# EAGLE design finalbspd (EAGLE 9.6.2)
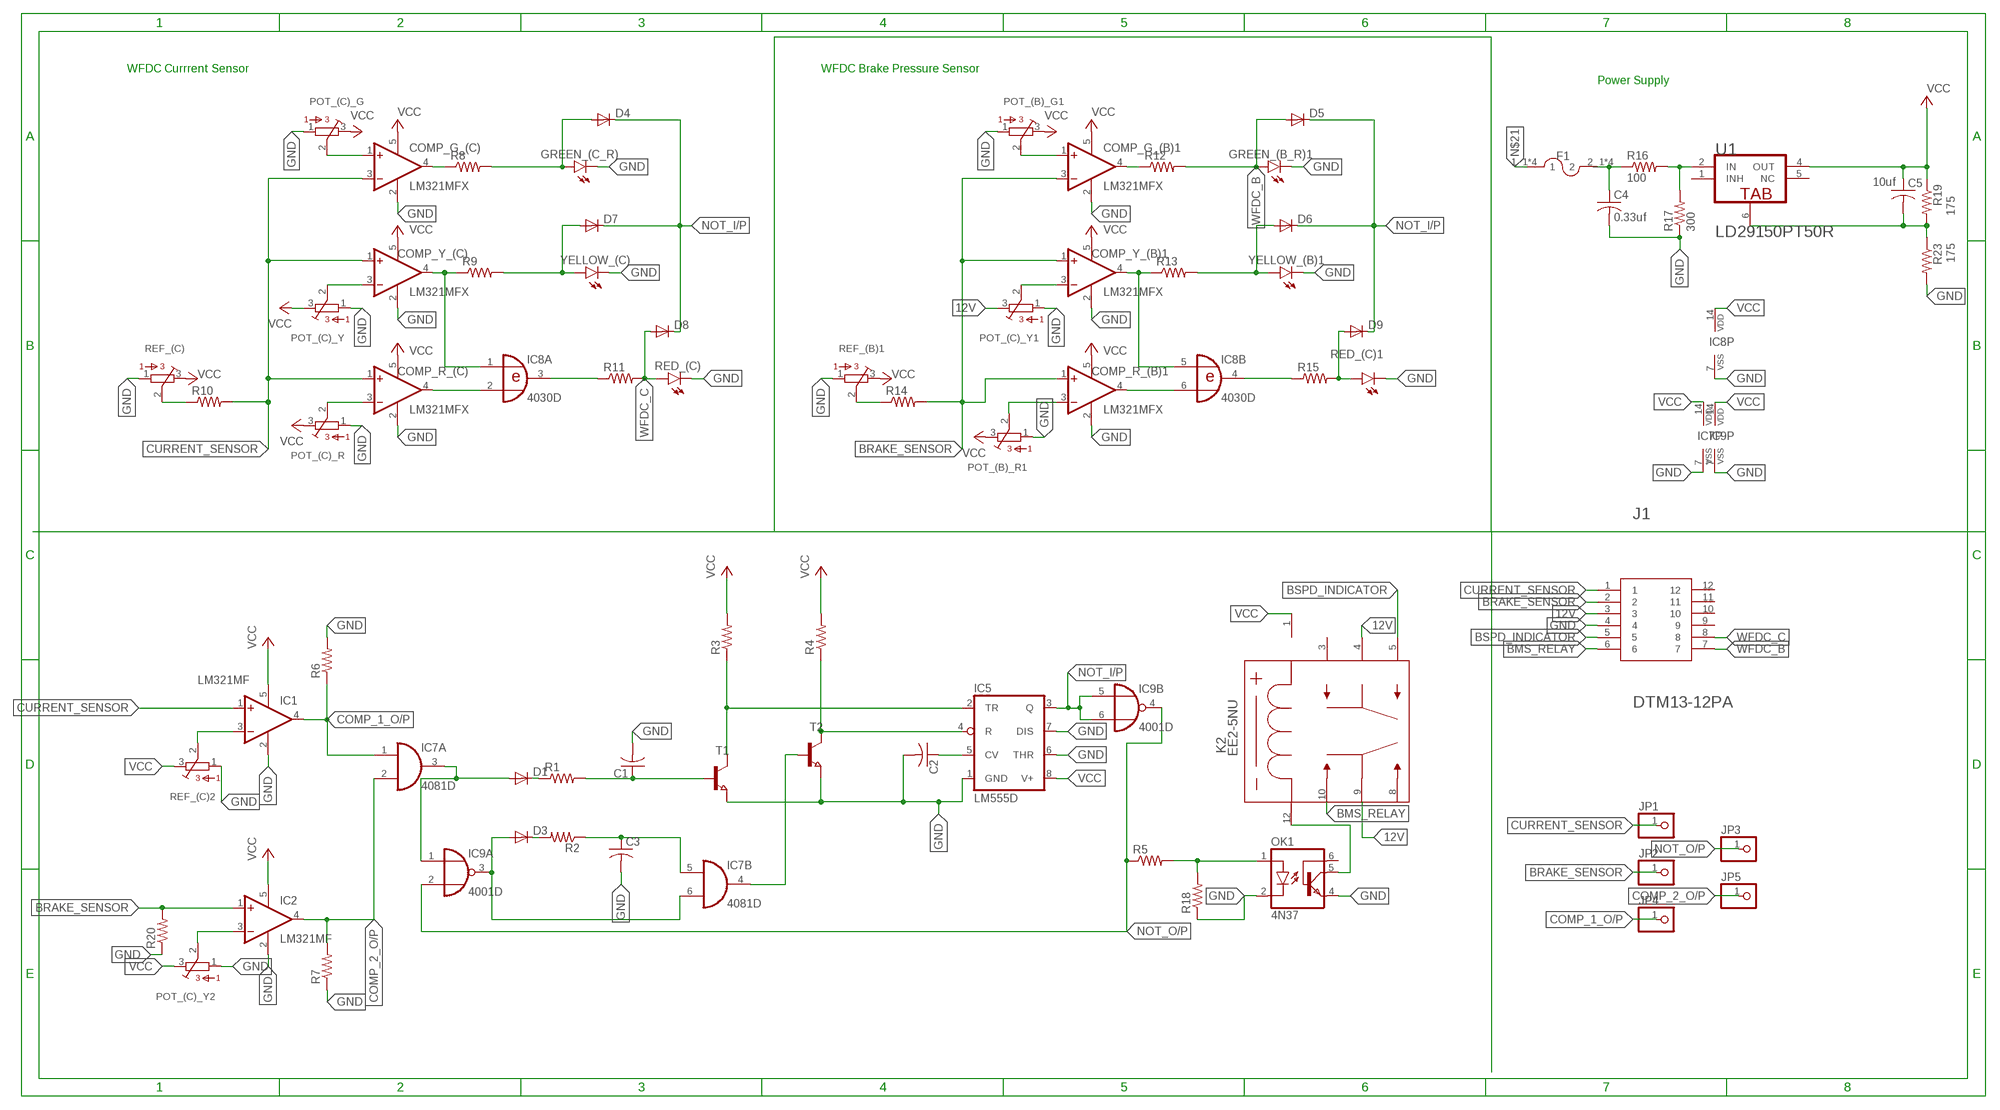
[diagram p0: schematic, sheet 1]

## Parts
C1  C-USC0402  [C0402]
C2  C-USC0402  [C0402]
C3  C-USC0402  [C0402]
C4  0.33uf  C-USC0402  [C0402]
C5  10uf  C-USC0402  [C0402]
COMP_G_(B)1  LM321MFX  [SOT23-5]
COMP_G_(C)  LM321MFX  [SOT23-5]
COMP_R_(B)1  LM321MFX  [SOT23-5]
COMP_R_(C)  LM321MFX  [SOT23-5]
COMP_Y_(B)1  LM321MFX  [SOT23-5]
COMP_Y_(C)  LM321MFX  [SOT23-5]
D1  DIODE-DO214AC  [DO214AC]
D3  DIODE-DO214AC  [DO214AC]
D4  DIODE-DO214AC  [DO214AC]
D5  DIODE-DO214AC  [DO214AC]
D6  DIODE-DO214AC  [DO214AC]
D7  DIODE-DO214AC  [DO214AC]
D8  DIODE-DO214AC  [DO214AC]
D9  DIODE-DO214AC  [DO214AC]
F1  178.4265.0002  [FUSE_178.4265.0002]
GREEN_(B_R)1  GREEN_(C)  LEDCHIP-LED0805  [CHIP-LED0805]
GREEN_(C_R)  GREEN_(C)  LEDCHIP-LED0805  [CHIP-LED0805]
IC1  LM321MF  [SOT23-5]
IC2  LM321MF  [SOT23-5]
IC5  LM555D  [SO08]
IC7  4081D  [SO14]
IC8  4030D  [SO14]
IC9  4001D  [SO14]
J1  DTM13-12PA  [TE_DTM13-12PA]
JP1  PINHD-1X1  [1X01]
JP2  PINHD-1X1  [1X01]
JP3  PINHD-1X1  [1X01]
JP4  PINHD-1X1  [1X01]
JP5  PINHD-1X1  [1X01]
K2  EE2-5NU  [EE2NU_KEM]
OK1  4N37  [DIL06]
POT_(B)_G1  3386-W  [3386W]
POT_(B)_R1  3386-W  [3386W]
POT_(C)_G  3386-W  [3386W]
POT_(C)_R  3386-W  [3386W]
POT_(C)_Y  3386-W  [3386W]
POT_(C)_Y1  3386-W  [3386W]
POT_(C)_Y2  3386-W  [3386W]
R1  R-US_M1406  [M1406]
R2  R-US_M1406  [M1406]
R3  R-US_M1406  [M1406]
R4  R-US_M1406  [M1406]
R5  R-US_M1406  [M1406]
R6  R-US_M1406  [M1406]
R7  R-US_M1406  [M1406]
R8  R-US_R1206  [R1206]
R9  R-US_R1206  [R1206]
R10  R-US_R1206  [R1206]
R11  R-US_R1206  [R1206]
R12  R-US_R1206  [R1206]
R13  R-US_R1206  [R1206]
R14  R-US_R1206  [R1206]
R15  R-US_R1206  [R1206]
R16  100  R-US_R1206  [R1206]
R17  300  R-US_R1206  [R1206]
R18  R-US_M1406  [M1406]
R19  175  R-US_R1206  [R1206]
R20  R-US_M1406  [M1406]
R23  175  R-US_R1206  [R1206]
RED_(C)  LEDCHIP-LED0805  [CHIP-LED0805]
RED_(C)1  LEDCHIP-LED0805  [CHIP-LED0805]
REF_(B)1  3386-W  [3386W]
REF_(C)  3386-W  [3386W]
REF_(C)2  3386-W  [3386W]
T1  NPN-TRANSISTOR_SOT23  [SOT23]
T2  NPN-TRANSISTOR_SOT23  [SOT23]
U1  STMICROELECTRONICS_LD29150PT50RSTMICROELECTRONICS_LD29150PT50R_0_2  [STMICROELECTRONICS_LD29150PT50R_2]
YELLOW_(B)1  LEDCHIP-LED0805  [CHIP-LED0805]
YELLOW_(C)  LEDCHIP-LED0805  [CHIP-LED0805]

## Nets
12V: C4.1 F1.2_1 F1.2_2 F1.2_3 F1.2_4 J1.3 K2.4 K2.9 POT_(C)_Y1.3 R16.1
BMS_RELAY: J1.6 K2.10
BRAKE_SENSOR: COMP_G_(B)1.3(-IN) COMP_R_(B)1.1(+IN) COMP_Y_(B)1.1(+IN) IC2.1(+IN) J1.2 JP2.1 R14.2 R20.2
BSPD_INDICATOR: J1.5 K2.5
COMP_1_O/P: IC1.4(OUT) IC7.1(A:I0) JP4.1 R6.1
COMP_2_O/P: IC2.4(OUT) IC7.2(A:I1) JP5.1 R7.2
CURRENT_SENSOR: COMP_G_(C).3(-IN) COMP_R_(C).1(+IN) COMP_Y_(C).1(+IN) IC1.1(+IN) J1.1 JP1.1 R10.2
GND: C1.2 C2.2 C3.2 C4.2 COMP_G_(B)1.2(V-) COMP_G_(C).2(V-) COMP_R_(B)1.2(V-) COMP_R_(C).2(V-) COMP_Y_(B)1.2(V-) COMP_Y_(C).2(V-) GREEN_(B_R)1.C GREEN_(C_R).C IC1.2(V-) IC2.2(V-) IC5.1(GND) IC5.6(THR) IC5.7(DIS) IC7.7(P:VSS) IC8.7(P:VSS) IC9.7(P:VSS) J1.4 OK1.2(C) OK1.4(EMI) POT_(B)_G1.1 POT_(B)_R1.1 POT_(C)_G.1 POT_(C)_R.1 POT_(C)_Y1.1 POT_(C)_Y2.1 POT_(C)_Y.1 R6.2 R7.1 R17.1 R18.1 R20.1 R23.2 RED_(C)1.C RED_(C).C REF_(B)1.1 REF_(C)2.1 REF_(C).1 T1.2(E) T2.2(E) YELLOW_(B)1.C YELLOW_(C).C
N$2: C1.1 R1.2 T1.1(B)
N$3: IC1.3(-IN) REF_(C)2.2
N$4: IC2.3(-IN) POT_(C)_Y2.2
N$5: COMP_R_(B)1.3(-IN) POT_(B)_R1.2
N$6: K2.12 OK1.5(COL)
N$7: D1.A IC7.3(A:O) IC9.1(A:I0)
N$8: C2.1 IC5.5(CV)
N$9: D1.C R1.1
N$10: D3.A IC7.6(B:I1) IC9.3(A:O)
N$11: D3.C R2.2
N$12: C3.1 IC7.5(B:I0) R2.1
N$14: IC5.2(TR) R3.1 T1.3(C)
N$15: IC5.4(R) R4.1 T2.3(C)
N$16: COMP_G_(C).4(OUT) R8.1
N$17: OK1.1(A) R5.2 R18.2
N$18: IC7.4(B:O) T2.1(B)
N$20: R16.2 R17.2 U1.2(IN)
N$21: F1.1_1 F1.1_2 F1.1_3 F1.1_4
N$22: COMP_Y_(C).4(OUT) IC8.1(A:I0) R9.1
N$23: COMP_R_(C).4(OUT) IC8.2(A:I1)
N$24: D4.A GREEN_(C_R).A R8.2
N$26: R10.1 REF_(C).2
N$27: COMP_Y_(C).3(-IN) POT_(C)_Y.2
N$28: IC8.3(A:O) R11.1
N$29: COMP_G_(B)1.4(OUT) R12.1
N$30: COMP_Y_(B)1.4(OUT) IC8.5(B:I0) R13.1
N$31: COMP_R_(B)1.4(OUT) IC8.6(B:I1)
N$33: D9.A R15.2 RED_(C)1.A
N$34: D7.A R9.2 YELLOW_(C).A
N$35: R14.1 REF_(B)1.2
N$36: COMP_Y_(B)1.3(-IN) POT_(C)_Y1.2
N$37: IC8.4(B:O) R15.1
N$38: D6.A R13.2 YELLOW_(B)1.A
N$39: C5.2 R19.2 R23.1 U1.6(TAB)
NOT_I/P: D4.C D5.C D6.C D7.C D8.C D9.C IC5.3(Q) IC9.5(B:I0) IC9.6(B:I1)
NOT_O/P: IC9.2(A:I1) IC9.4(B:O) JP3.1 R5.1
VCC: C5.1 COMP_G_(B)1.1(+IN) COMP_G_(B)1.5(V+) COMP_G_(C).1(+IN) COMP_G_(C).5(V+) COMP_R_(B)1.5(V+) COMP_R_(C).3(-IN) COMP_R_(C).5(V+) COMP_Y_(B)1.5(V+) COMP_Y_(C).5(V+) IC1.5(V+) IC2.5(V+) IC5.8(V+) IC7.14(P:VDD) IC8.14(P:VDD) IC9.14(P:VDD) K2.1 POT_(B)_G1.2 POT_(B)_G1.3 POT_(B)_R1.3 POT_(C)_G.2 POT_(C)_G.3 POT_(C)_R.2 POT_(C)_R.3 POT_(C)_Y2.3 POT_(C)_Y.3 R3.2 R4.2 R19.1 REF_(B)1.3 REF_(C)2.3 REF_(C).3 U1.4(OUT)
WFDC_B: D5.A GREEN_(B_R)1.A J1.7 R12.2
WFDC_C: D8.A J1.8 R11.2 RED_(C).A
Unconnected: IC7.8(C:I0) IC7.9(C:I1) IC7.10(C:O) IC7.11(D:O) IC7.12(D:I0) IC7.13(D:I1) IC8.8(C:I0) IC8.9(C:I1) IC8.10(C:O) IC8.11(D:O) IC8.12(D:I0) IC8.13(D:I1) IC9.8(C:I0) IC9.9(C:I1) IC9.10(C:O) IC9.11(D:O) IC9.12(D:I0) IC9.13(D:I1) J1.9 J1.10 J1.11 J1.12 K2.3 K2.8 OK1.6(BAS) U1.1(INH) U1.5(NC)

## Notes on the sheet
- WFDC Currrent Sensor | WFDC Brake Pressure Sensor
- Power Supply

## Library data of the parts
C1-C5 = adafruit:C-US: CAPACITOR, American symbol
COMP_G_(B)1 COMP_G_(C) COMP_R_(B)1 COMP_R_(C) COMP_Y_(B)1 COMP_Y_(C) IC1 IC2 = linear:LM321?*: Low Power Single Op Amp Source: http://cache.national.com/ds/LM/LM321.pdf
D1 D3-D9 = diode:DIODE-: DIODE
F1 = 178.4265.0002:178.4265.0002: Fuse holder [Littelfuse] 178.4265.0002 Fuse holder 4005084016264 Buy Part <https://snapeda.com/parts/178.4265.0002/Littelfuse%20Inc./view-part/?ref=eda>; ARROW_ELECTRONICS-PURCHASE-URL: https://snapeda.com/shop?store=Arrow+Electronics&id=1314086; AVAILABILITY: Warning; DESCRIPTION: Fuse Block 58V 1 Circuit Blade Through Hole; DIGIKEY-PURCHASE-URL: https://snapeda.com/shop?store=DigiKey&id=1314086; MF: Littelfuse Inc.; MOUSER-PURCHASE-URL: https://snapeda.com/shop?store=Mouser&id=1314086; MP: 178.4265.0002; PACKAGE: None; PRICE: None
GREEN_(B_R)1 GREEN_(C_R) RED_(C) RED_(C)1 YELLOW_(B)1 YELLOW_(C) = led:LED: LED OSRAM: - CHIPLED LG R971, LG N971, LY N971, LG Q971, LY Q971, LO R971, LY R971 LH N974, LH R974 LS Q976, LO Q976, LY Q976 LO Q996 - Hyper CHIPLED LW Q18S LB Q993, LB Q99A, LB R99A - SideLED LS A670, LO A670, LY A670, LG A670, LP A670 LB A673, LV A673, LT A673, LW A673 LH A674 LY A675 LS A676, LA A676, LO A676, LY A676, LW A676 LS A679, LY A679, LG A679 - Hyper Micro SIDELED® LS Y876, LA Y876, LO Y876, LY Y876 LT Y87S - SmartLED LW L88C, LW L88S LB L89C, LB L89S, LG L890 LS L89K, LO L89K, LY L89K LS L896, LA L896, LO L896, LY L896 - TOPLED LS T670, LO T670, LY T670, LG T670, LP T670 LSG T670, LSP T670, LSY T670, LOP T670, LYG T670 LG T671, LOG T671, LSG T671 LB T673, LV T673, LT T673, LW T673 LH T674 LS T676, LA T676, LO T676, LY T676, LB T676, LH T676, LSB T676, LW T676 LB T67C, LV T67C, LT T67C, LS T67K, LO T67K, LY T67K, LW E67C LS E67B, LA E67B, LO E67B, LY E67B, LB E67C, LV E67C, LT E67C LW T67C LS T679, LY T679, LG T679 LS T770, LO T770, LY T770, LG T770, LP T770 LB T773, LV T773, LT T773, LW T773 LH T774 LS E675, LA E675, LY E675, LS T675 LS T776, LA T776, LO T776, LY T776, LB T776 LHGB T686 LT T68C, LB T68C - Hyper Mini TOPLED® LB M676 - Mini TOPLED Santana® LG M470 LS M47K, LO M47K, LY M47K Source: http://www.osram.convergy.de LUXEON: - LUMILED® LXK2-PW12-R00, LXK2-PW12-S00, LXK2-PW14-U00, LXK2-PW14-V00 LXK2-PM12-R00, LXK2-PM12-S00, LXK2-PM14-U00 LXK2-PE12-Q00, LXK2-PE12-R00, LXK2-PE12-S00, LXK2-PE14-T00, LXK2-PE14-U00 LXK2-PB12-K00, LXK2-PB12-L00, LXK2-PB12-M00, LXK2-PB14-N00, LXK2-PB14-P00, LXK2-PB14-Q00 LXK2-PR12-L00, LXK2-PR12-M00, LXK2-PR14-Q00, LXK2-PR14-R00 LXK2-PD12-Q00, LXK2-PD12-R00, LXK2-PD12-S00 LXK2-PH12-R00, LXK2-PH12-S00 LXK2-PL12-P00, LXK2-PL12-Q00, LXK2-PL12-R00 Source: www.luxeon.com KINGBRIGHT: KA-3528ASYC Source: www.kingbright.com
IC5 = adafruit:*555: TIMER Changed DIP package to have round (not oval) pin pads http://www.ladyada.net/library/pcb/eaglelibrary.html
IC7 = 40xx:4081: Quad 2-input AND
IC8 = 40xx:4030: Quad XOR
IC9 = 40xx:4001: Quad 2-input NOR
J1 = DTM13-12PA:DTM13-12PA: 12 way DTM13 A key Receptacle with PCB mount and 90 degree molded pins. Sealable, with centerline pitch .165 inch/4 m...; COMMENT: DTM13-12PA; DESCRIPTION: 12 way DTM13 A key Receptacle with PCB mount and 90 degree molded pins. Sealable, with centerline pitch .165 inch/4 millimeters. Gray.; DIGI-KEY_PART_NUMBER: 1734-1130-ND; DIGIKEY-PURCHASE-URL: https://snapeda.com/shop?store=DigiKey&id=570989; EU_ROHS_COMPLIANCE: Compliant; MF: TE Connectivity; MOUSER-PURCHASE-URL: https://snapeda.com/shop?store=Mouser&id=570989; MP: DTM13-12PA; PACKAGE: None
JP1-JP5 = adafruit:PINHD-1X1: Pin header 1x1 for 0.1" spacing With round pins
K2 = 5V EE NUX:EE2-5NU; BUILT_BY: EMA_UL_Team; MANUFACTURER_PART_NUMBER: EE2-5NU; SOURCELIBRARY: Kemet_2014-12-31; VENDOR: KEMET
OK1 = optocoupler:4N37: OPTO COUPLER Source: http://www.fairchildsemi.com/pf/4N/4N35-M.html; MF: FAIRCHILD SEMICONDUCTOR; MPN: 4N37; OC_FARNELL: 1612456; OC_NEWARK: 72K9948
POT_(B)_G1 POT_(B)_R1 POT_(C)_G POT_(C)_R POT_(C)_Y POT_(C)_Y1 POT_(C)_Y2 REF_(B)1 REF_(C) REF_(C)2 = bourns:3386-: 3386 Series 3/8" Square Trimmer
R1-R7 R18 R20 = adafruit:R-US_: RESISTOR, American symbol
R8-R17 R19 R23 = rcl:R-US_: RESISTOR, American symbol; SPICEPREFIX: R
T1 T2 = semicon-smd-ipc:NPN-TRANSISTOR_: NPN TRANSISTOR
U1 = STMicroelectronics - LD29150PT50R:STMICROELECTRONICS_LD29150PT50R: PM-REG-LD29150-SOT5; CIIVA_IDS: 1497735; COMPONENT_LINK_1_DESCRIPTION: Manufacturer URL; COMPONENT_LINK_1_URL: http://www.st.com; DATASHEET: http://www.st.com/internet/com/TECHNICAL_RESOURCES/TECHNICAL_LITERATURE/DATASHEET/CD00003403.pdf; DATASHEET_VERSION: 27/10/2010; FOOTPRINT_VARIANT_NAME_0: Level C; FOOTPRINT_VARIANT_NAME_1: Level B; FOOTPRINT_VARIANT_NAME_2: Level A; IMPORTED: yes; IMPORTED_FROM: vault; IMPORT_TS: 1521859312; MF: STMicroelectronics; MPN: LD29150PT50R; PACKAGE: PPAK; PACKAGE_DESCRIPTION: 5-Pin Transistor Outline Package 1.27 mm Pitch, 9.7 mm Lead Span; PACKAGE_VERSION: 1/06/2004; PREFIX: U; RELEASE_DATE: 1329863989; VAULT_GUID: 02357045-E139-42C3-9262-8B8E07D20530; VAULT_REVISION: 1C60A96D-1D8C-4367-84F9-481219294C1F

## Board
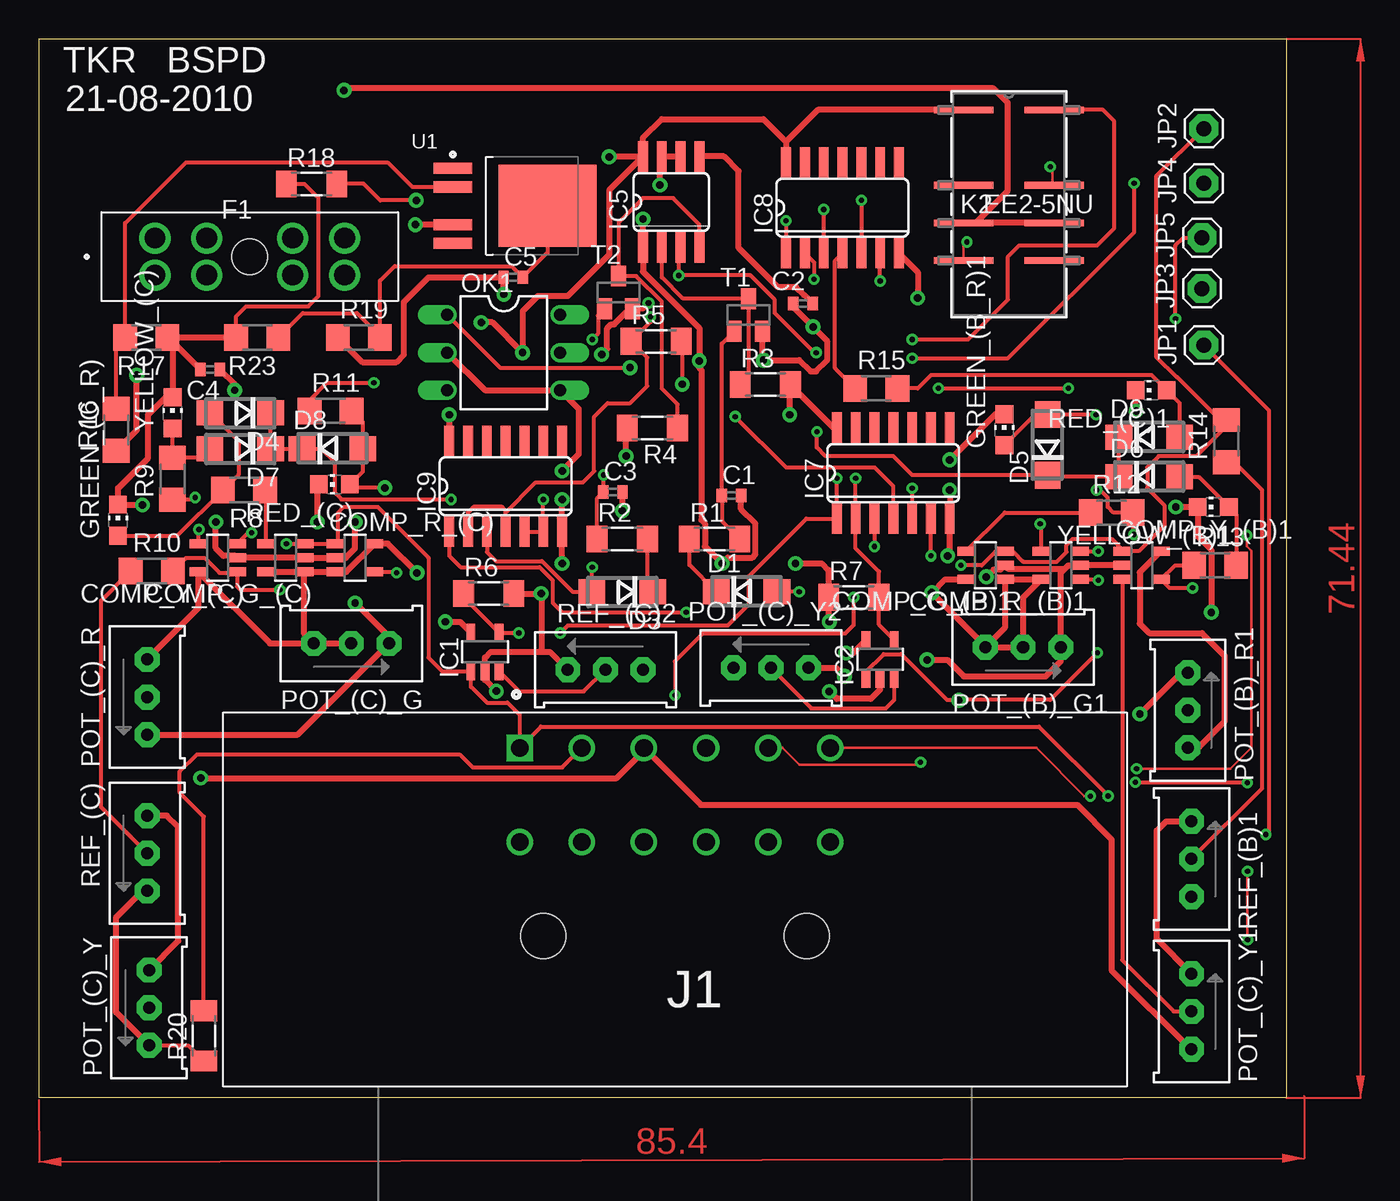
[diagram p1: board, top side]
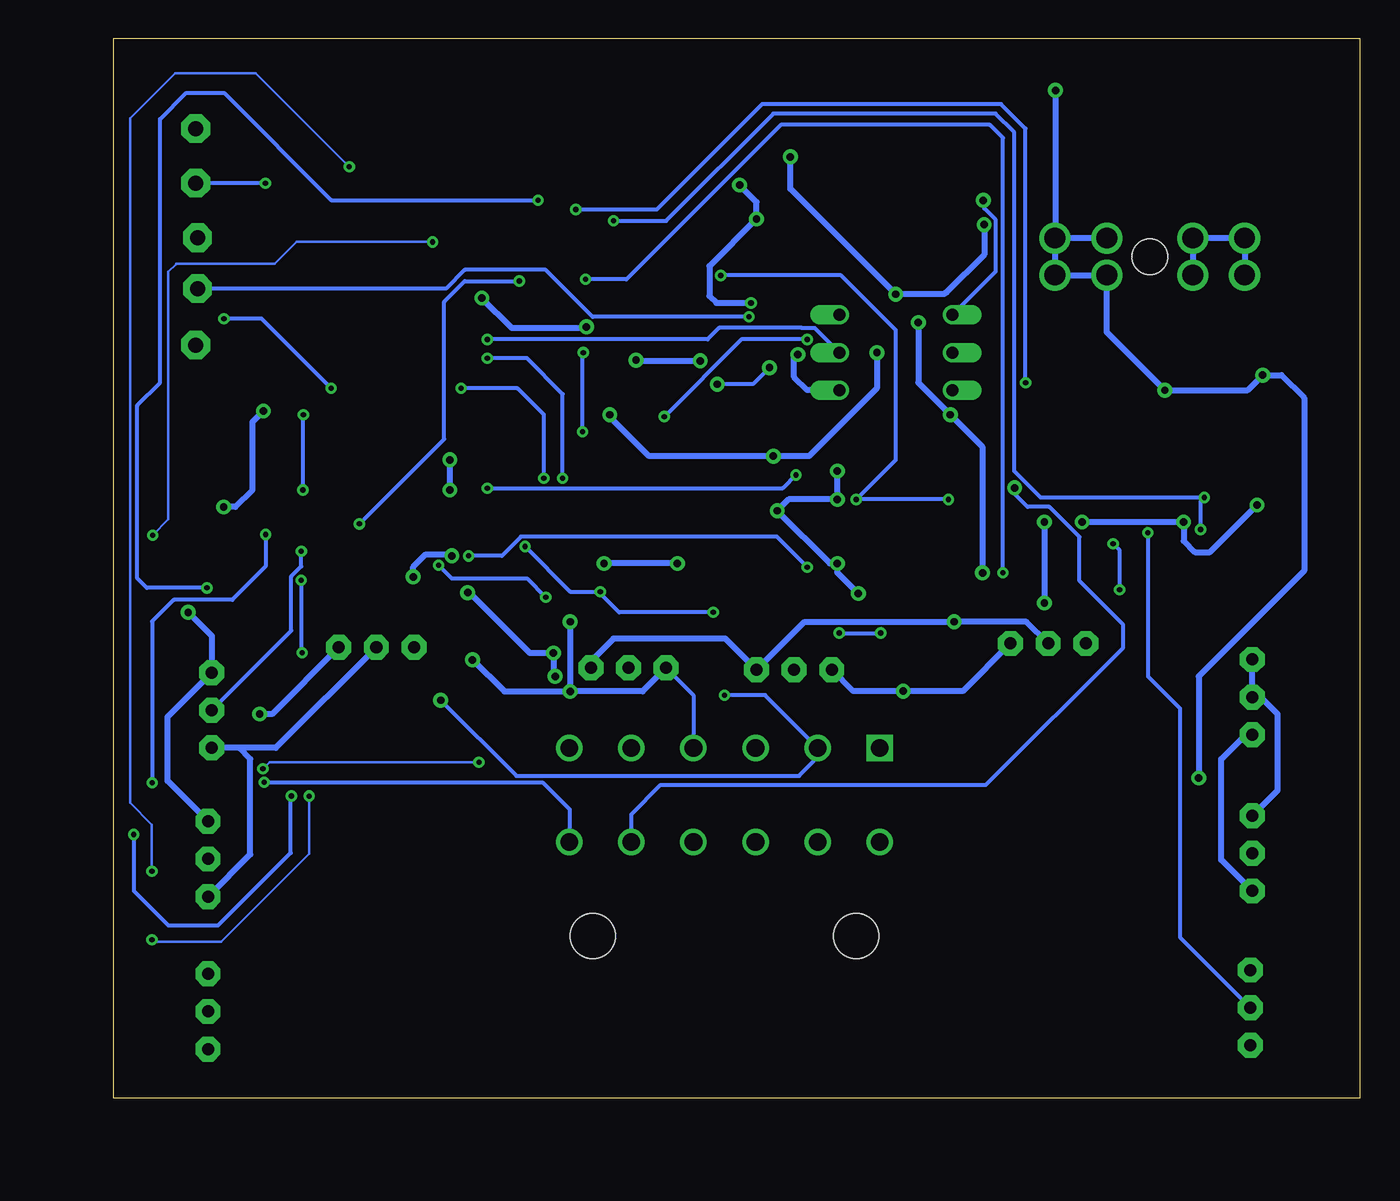
[diagram p2: board, bottom side, seen from below]

Size 84.18 x 71.44 mm. Coordinates in mm from the lower left corner, seen from the top.
Outline: 0.01,71.44 84.18,71.44 84.18,0 0,0 0,71.44 0.01,71.44
Copper layers (1*16): Top 0.035mm / dielectric 1.5mm / Bottom 0.035mm
Design rules "default": minimum track width 6mil, minimum drill 0.35mm, track to track 6mil, track to pad 6mil, pad to pad 6mil, via to via 6mil, smd to smd 6mil, copper to edge 40mil, drill to drill 6mil, minimum pad ring 10mil, minimum via ring 8mil, stop-mask expansion 4mil, vias tented up to drill 0mil, thermal gap 10mil

### Footprints (pad centres in the part's own frame; a part is rotated, then mirrored left to right if it is on the bottom)
C0402 = smd 0.7 x 0.9: 1 -0.65,0; 2 0.65,0
SOT23-5 = smd 0.6 x 1.2: 1 -0.95,-1.306; 2 0,-1.306; 3 0.95,-1.306; 4 0.95,1.306; 5 -0.95,1.306
DO214AC = smd 1.8 x 1.7: A 2.05,0; C -2.05,0
FUSE_178.4265.0002 = drill 1.4: 1_1 -6.4,1.25; 1_2 -2.9,1.25; 1_3 -6.4,-1.25; 1_4 -2.9,-1.25; 2_1 2.9,1.25; 2_2 6.4,1.25; 2_3 2.9,-1.25; 2_4 6.4,-1.25 | hole 2.4: 0,0
CHIP-LED0805 = smd 1.2 x 1.2: A 0,-1.05; C 0,1.05
SO08 = smd 0.66 x 2.032: 1 -1.905,-3.073; 2 -0.635,-3.073; 3 0.635,-3.073; 4 1.905,-3.073; 5 1.905,3.073; 6 0.635,3.073; 7 -0.635,3.073; 8 -1.905,3.073
SO14 = smd 0.66 x 2.032: 1 -3.81,-3.073; 2 -2.54,-3.073; 3 -1.27,-3.073; 4 0,-3.073; 5 1.27,-3.073; 6 2.54,-3.073; 7 3.81,-3.073; 8 3.81,3.073; 9 2.54,3.073; 10 1.27,3.073; 11 0,3.073; 12 -1.27,3.073; 13 -2.54,3.073; 14 -3.81,3.073
TE_DTM13-12PA = drill 1.2 pad 1.8 square: 1 -10.48,12.7 | drill 1.2 pad 1.8: 2 -6.29,12.7; 3 -2.1,12.7; 4 2.1,12.7; 5 6.29,12.7; 6 10.48,12.7; 7 10.48,6.35; 8 6.29,6.35; 9 2.1,6.35; 10 -2.1,6.35; 11 -6.29,6.35; 12 -10.48,6.35 | hole 3.04: 8.89,0; -8.89,0
1X01 = drill 1.016 pad 1.93 octagon: 1 0,0
EE2NU_KEM = smd 4.005 x 0.457: 1 -3.052,6.35; 3 -3.052,1.27; 4 -3.052,-1.27; 5 -3.052,-3.81; 8 3.052,-3.81; 9 3.052,-1.27; 10 3.052,1.27; 12 3.052,6.35
DIL06 = drill 0.813 offset: 1 -2.54,-3.81; 2 0,-3.81; 3 2.54,-3.81; 4 2.54,3.81; 5 0,3.81; 6 -2.54,3.81
3386W = drill 0.813 pad 1.676 octagon: 1 2.54,0.318; 2 0,0.318; 3 -2.54,0.318
M1406 = smd 1.4 x 1.8: 1 -1.7,0; 2 1.7,0
R1206 = smd 1.6 x 1.803: 1 -1.422,0; 2 1.422,0
SOT23 = smd 1 x 1.4: 1 -0.95,-1.1; 2 0.95,-1.1; 3 0,1.1
STMICROELECTRONICS_LD29150PT50R_2 = smd 2.6 x 0.75: 1 -4.2,2.54; 2 -4.2,1.27; 4 -4.2,-1.27; 5 -4.2,-2.54 | smd 6.6 x 5.55: 6 2.2,0

### Placement (x,y rotation side)
C1  46.72,40.63 0 top
C2  51.55,53.58 180 top
C3  38.72,40.88 0 top
C4  11.54,49.14 180 top
C5  31.99,55.36 0 top
COMP_G_(B)1  63.87,35.93 90 top
COMP_G_(C)  16.62,36.44 90 top
COMP_R_(B)1  68.95,35.93 90 top
COMP_R_(C)  21.32,36.44 270 top
COMP_Y_(B)1  74.41,35.93 270 top
COMP_Y_(C)  12.05,36.44 90 top
D1  47.74,34.15 0 top
D3  39.36,34.15 180 top
D4  13.58,46.22 180 top
D5  68.06,44.06 90 top
D6  74.92,41.9 0 top
D7  13.58,43.8 180 top
D8  19.8,43.8 0 top
D9  74.92,44.56 0 top
F1  14.21,56.76 0 top
GREEN_(B_R)1  65.14,45.07 0 top
GREEN_(C_R)  5.32,38.98 0 top
IC1  30.09,30.09 0 top
IC2  56.76,29.58 0 top
IC5  42.66,60.44 0 top
IC7  57.65,42.15 0 top
IC8  54.22,60.06 0 top
IC9  31.48,41.26 0 top
J1  42.91,10.91 0 top
JP1  78.6,50.79 90 top
JP2  78.6,65.39 90 top
JP3  78.47,54.6 90 top
JP4  78.6,61.71 90 top
JP5  78.47,58.03 90 top
K2  65.44,60.3 0 top
OK1  31.36,50.28 270 top
POT_(B)_G1  66.41,30.09 0 top
POT_(B)_R1  77.84,26.15 90 top
POT_(C)_G  21.07,30.34 0 top
POT_(C)_R  6.97,27.04 270 top
POT_(C)_Y  7.1,6.08 270 top
POT_(C)_Y1  78.09,5.83 90 top
POT_(C)_Y2  49.39,29.32 180 top
R1  45.58,37.71 0 top
R2  39.36,37.71 0 top
R3  49.01,48.12 0 top
R4  41.39,45.2 180 top
R5  41.64,51.04 0 top
R6  30.34,34.02 0 top
R7  54.98,33.77 0 top
R8  13.83,41.01 180 top
R9  9,41.77 90 top
R10  7.61,35.55 0 top
R11  19.67,46.34 0 top
R12  72.38,39.48 0 top
R13  79.36,35.93 0 top
R14  80.12,44.31 90 top
R15  56.5,47.87 0 top
R16  5.19,45.07 90 top
R17  7.23,51.3 180 top
R18  18.39,61.65 0 top
R19  21.58,51.3 0 top
R20  11.11,4.18 90 top
R23  14.72,51.3 180 top
RED_(C)  19.93,41.39 90 top
RED_(C)1  75.04,47.74 90 top
REF_(B)1  78.09,16.12 90 top
REF_(C)  6.97,16.5 270 top
REF_(C)2  38.21,29.2 180 top
T1  47.87,52.82 0 top
T2  39.1,54.34 0 top
U1  32.12,60.19 0 top
YELLOW_(B)1  79.24,39.87 90 top
YELLOW_(C)  9,46.22 0 top

### Tracks (layer width: path | path; a pad name or v marks a point on that pad's centre or on a via)
12V  (via drill 0.5 pad 1)
  Top 0.406: R16.1 6.59,45.05 v6.59,48.76 | v13.2,47.74 13.2,48.14 C4.1 | POT_(C)_Y1.3 77.71,3.29 72.38,8.62 72.38,17.44 70.05,19.76 44.66,19.76 J1.3 40.81,23.41 38.98,21.58 v10.91,21.58 | K2.9 K2.4 63.21,59.03 65.38,61.2 65.38,67.15 64.41,68.11 20.71,68.11 v20.57,67.97
  Bottom 0.406: v10.91,21.58 10.91,28.44 3.8,35.55 3.8,47.23 5.32,48.76 v6.59,48.76 7.61,47.74 v13.2,47.74 17.11,51.66 F1.2_3 F1.2_4 F1.2_2 20.57,58.04 | v20.57,67.97 20.57,58.04 | F1.2_1 20.54,58.01 20.57,58.04
BMS_RELAY  (via drill 0.35)
  Top 0.152: K2.10 68.39,61.68 68.39,62.66 v68.24,62.81 | J1.6 67.3,23.61 70.55,20.36 v70.96,20.36 | v81.55,10.66 81.55,15.23 81.58,15.27 v81.56,15.29
  Bottom 0.152: v68.24,62.81 74.56,69.14 80,69.14 83.03,66.1 83.03,19.91 81.56,18.44 v81.56,15.29 | v70.96,20.36 70.96,16.48 76.9,10.54 81.29,10.54 81.48,10.73 v81.55,10.66
BRAKE_SENSOR  (via drill 0.35 pad 0.7, 0.35 pad 0.75, 0.5 pad 1)
  Top 0.254: v62.22,35.93 63.61,35.93 64.56,36.88 COMP_G_(B)1.3 65.71,36.88 66.41,36.18 68.69,36.18 69.33,36.82 69.33,37.29 69.75,37.71 72.39,37.71 73.1,36.99 COMP_Y_(B)1.1 74.22,36.88 75.93,38.6 75.93,39.99 74.79,41.14 74.79,42.53 75.55,43.29 78.09,43.29 80.12,45.33 R14.2 79.7,45.73 76.81,48.62 76.77,48.62 75.37,50.01 75.37,62.17 JP2.1 | v42.91,27.17 42.91,29.45 44.82,31.36 52.99,31.36 53,31.34 54.4,31.34 54.98,31.92 v54.98,33.77 | 62.07,26.85 61.27,26.85 58.18,29.93 57,29.93 55.81,28.74 IC2.1 | 62.07,26.85 v62.07,26.82 | R20.2 11.11,18.97 9.5,20.59 9.5,22.02 10.66,23.18 28.37,23.18 29.26,22.29 35.3,22.29 J1.2 | COMP_R_(B)1.1 71.42,34.98 v71.49,34.91 | v71.41,30.02 68.24,26.85 62.07,26.85
  Bottom 0.254: v62.22,35.93 61.33,35.04 56.25,35.04 v54.98,33.77 | v62.07,26.82 56.96,21.72 37.88,21.72 36.62,22.98 J1.2 40.18,27.17 v42.91,27.17 | v71.49,34.91 71.49,30.02 v71.41,30.02
BSPD_INDICATOR  (via drill 0.35)
  Top 0.152: K2.5 62.39,57.48 62.64,57.72 v62.61,57.75 | v81.51,37.96 81.51,37.23 81.81,36.92 81.81,23.62 80.39,22.19 v74.07,22.19 | v59.49,22.64 59.32,22.48 51.3,22.48 50.17,23.61 J1.5
  Bottom 0.152: v62.61,57.75 71.79,57.75 73.28,56.26 79.93,56.26 79.93,56.24 80.44,55.73 80.44,39.03 v81.51,37.96 | v74.07,22.19 73.62,22.64 v59.49,22.64
COMP_1_O/P  (via drill 0.35 pad 0.7)
  Top 0.254: R6.1 28.64,33.79 IC1.4 31.07,31.36 v32.37,31.36 | v35.17,31.36 35.67,31.86 46.47,31.86 47.87,33.26 47.87,35.17 51.78,39.08 IC7.1 v53.84,41.79 | v58.92,49.9 65.39,49.9 73.9,58.41 v73.9,61.71
  Bottom 0.254: v35.17,31.36 v32.37,31.36 | v53.84,41.79 53.84,47.49 56.25,49.9 v58.92,49.9 | v73.9,61.71 JP4.1
COMP_2_O/P  (via drill 0.35 pad 0.7)
  Top 0.254: IC2.4 56.68,31.91 R7.2 56.68,35.5 55.11,37.07 IC7.2 v55.11,41.79 | v60.69,47.87 v69.46,47.87 | v76.7,52.57 76.7,57.52 77.2,58.03 JP5.1
  Bottom 0.254: v55.11,41.79 55.11,46.09 56.88,47.87 v60.69,47.87 | v69.46,47.87 74.16,52.57 v76.7,52.57
CURRENT_SENSOR  (via drill 0.35 pad 0.7, 0.35 pad 0.75)
  Top 0.254: R10.2 9.92,36.44 11.16,36.44 12.18,35.42 13.29,35.42 COMP_Y_(C).1 13.36,34.5 13.58,34.28 v16.24,34.28 | v16.69,37.39 COMP_G_(C).3 COMP_R_(C).1 20.18,37.55 20.18,39.48 20.56,39.87 22.85,39.87 26.28,36.44 26.28,29.71 27.2,28.78 IC1.1 29.14,27.73 30.21,26.66 31.61,26.66 32.43,25.83 J1.1 33.87,25.04 67.48,25.04 v72.15,20.37 | JP1.1 82.98,46.41 82.98,17.87 82.88,17.87 v82.78,17.77
  Bottom 0.254: v16.24,34.28 16.24,36.94 v16.69,37.39 | v82.78,17.77 82.78,13.96 80.45,11.63 77.09,11.63 72.19,16.54 72.19,20.37 v72.15,20.37
GND  (via drill 0.4 pad 0.8, 0.5 pad 1)
  Top 0.254: R23.2 13.3,52.74 13.96,53.4 18.16,53.4 18.86,54.1 18.86,60.69 17.91,61.65 R18.1 | POT_(C)_Y.1 10.05,3.54 R20.1
  Top 0.406: IC5.6 IC5.7 41.9,63.39 v41.9,61.58 | v40.75,59.3 IC5.1 40.75,55.74 44.56,51.93 44.56,49.74 v44.55,49.72 44.55,49.27 44.7,49.12 44.7,38.99 44.94,38.75 44.94,37.21 v46.09,36.06 46.48,36.45 48.13,36.45 48.34,36.66 48.34,38.75 47.37,39.72 C1.2 | POT_(C)_Y.1 5.19,5.77 5.19,12.18 6.97,13.96 REF_(C).1 | v11.93,38.85 11.93,37.07 12.43,36.56 13.23,36.56 COMP_Y_(C).2 COMP_G_(C).2 COMP_R_(C).2 20.69,36.44 21.32,37.07 v21.32,38.85 | v18.78,38.85 18.78,41.3 RED_(C).C | v6.97,39.99 5.36,39.99 GREEN_(C_R).C 5.32,41.14 7.35,43.17 7.35,46.09 8.53,47.27 YELLOW_(C).C 9,50.94 R17.1 8.74,51.3 | POT_(C)_R.1 17.45,24.5 POT_(C)_G.1 23.61,31.1 v21.32,33.39 | 8.74,51.3 C4.2 | v30.85,27.44 30.09,28.2 IC1.2 30.09,29.71 30.47,30.09 33.9,30.09 | OK1.2 30.09,47.74 OK1.4 36.44,46.47 36.44,43.44 v35.29,42.3 | 33.9,30.09 34.47,30.09 REF_(C)2.1 | v35.29,36.06 IC9.7 v35.29,40.37 | R6.2 v33.88,34.02 33.9,34.01 33.9,30.09 | v39.36,39.61 39.36,40.87 C3.2 | v37.96,50.15 38.34,50.53 38.34,51.93 38.6,52.19 38.8,52.19 39.86,53.24 T2.2 40.74,53.24 v41.12,53.63 | T1.2 48.82,49.84 v48.88,49.77 51.3,49.77 52.06,49.01 52.44,49.01 53.2,49.77 53.2,51.04 v52.23,52.01 50.9,53.34 C2.2 | v51.04,36.06 52.82,36.06 53.28,35.6 R7.1 53.28,32.17 v53.33,32.12 | v53.33,27.42 53.84,26.91 56.12,26.91 56.76,27.55 IC2.2 | IC8.7 59.3,55.72 v59.3,53.96 | GREEN_(B_R)1.C 64.54,46.12 v61.46,43.04 | v61.46,41.01 IC7.7 61.46,36.56 v61.31,36.56 | 69.2,35.67 68.95,35.42 POT_(B)_G1.1 68.95,29.45 67.93,28.44 62.41,28.44 61.29,29.55 v59.92,29.55 | 69.2,35.67 69.46,35.93 COMP_R_(B)1.2 COMP_Y_(B)1.2 | POT_(C)_Y1.1 75.43,10.72 75.43,18.02 76.06,18.66 REF_(B)1.1
  Top 0.406: v74.28,25.9 77.08,28.69 POT_(B)_R1.1 | v79.11,32.75 v79.1,32.77 79.1,36.98 78.19,37.89 YELLOW_(B)1.C v76.71,39.87 | RED_(C)1.C 73.99,46.38 v74.03,46.34 | R23.2 8.74,51.3 | v63.92,35.15 63.94,35.15 64.43,35.63 64.88,35.63 COMP_G_(B)1.2 65.43,35.67 69.2,35.67
  Bottom 0.254: POT_(C)_Y2.1 45.01,27.17 J1.4
  Bottom 0.406: v41.9,61.58 40.75,60.44 v40.75,59.3 43.93,56.12 43.93,54.09 43.47,53.63 v41.12,53.63 | REF_(C).1 9.39,16.05 9.39,22.85 7.73,24.5 POT_(C)_R.1 | v18.78,38.85 v11.93,38.85 11.93,37.58 11.16,36.82 10.15,36.82 v6.97,39.99 | v21.32,38.85 v21.32,33.39 | POT_(C)_G.1 26.83,27.44 v30.85,27.44 34.23,27.44 REF_(C)2.1 | v33.88,34.02 35.29,35.44 v35.29,36.06 35.8,36.06 v39.36,39.61 38.6,40.37 v35.29,40.37 v35.29,42.3 | OK1.4 37.33,47.74 38.21,48.63 38.21,50.03 38.09,50.15 v37.96,50.15 | v44.55,49.72 48.83,49.72 v48.88,49.77 | v46.09,36.06 v51.04,36.06 | v53.33,32.12 v53.33,27.42 | POT_(C)_Y2.1 48.44,27.42 v53.33,27.42 | v59.92,29.55 v59.91,29.55 57.77,27.42 v53.33,27.42 | v52.23,52.01 52.29,51.95 57.28,51.95 v59.3,53.96 | v61.46,43.04 v61.46,41.01 | REF_(B)1.1 80.51,21.39 80.51,25.7 POT_(B)_R1.1 77.52,31.17 v79.11,32.75 | POT_(B)_G1.1 73.46,25.9 v74.28,25.9 | v74.03,46.34 74.79,45.58 74.79,41.01 75.93,39.87 v76.71,39.87 | v63.92,35.15 63.92,35.82 63.08,36.66 61.41,36.66 v61.31,36.56
N$2
  Top 0.254: R1.2 46.07,38.91 C1.1 46.07,50.88 T1.1
N$3
  Top 0.254: IC1.3 32.4,27.42 36.75,27.42 REF_(C)2.2
N$4
  Top 0.254: POT_(C)_Y2.2 52.12,26.28 57.14,26.28 57.71,26.85 IC2.3
N$5  (via drill 0.35 pad 0.75)
  Top 0.254: COMP_R_(B)1.3 71.47,36.88 v71.48,36.87
  Bottom 0.254: v71.48,36.87 71.48,35.86 72.15,35.18 72.15,31.52 POT_(B)_R1.2
N$6  (via drill 0.35 pad 0.7)
  Top 0.254: v58.92,51.17 62.71,51.17 65.39,53.85 65.39,56.76 66.15,57.52 71.41,57.52 72.52,58.62 72.52,65.93 71.79,66.65 K2.12
  Bottom 0.254: OK1.5 36.82,51.93 37.67,51.93 37.69,51.95 43.27,51.95 44.06,51.17 v58.92,51.17
N$7  (via drill 0.35 pad 0.7)
  Top 0.254: IC7.3 v56.38,37.2 | v51.3,34.15 D1.A | IC9.1 27.67,36.56 28.44,35.8 33.77,35.8 34.09,35.48 34.66,34.91 34.66,33.39 35.29,32.75 v43.68,32.75
  Bottom 0.254: v56.38,37.2 53.33,34.15 51.42,34.15 | 51.42,34.15 v51.3,34.15 | v43.68,32.75 50.03,32.75 51.42,34.15
N$8
  Top 0.406: C2.1 51.61,54.18 51.08,54.7 49.85,54.7 47.21,57.34 47.21,62.52 46.22,63.51 IC5.5
N$9
  Top 0.254: D1.C 43.88,35.96 R1.1
N$10  (via drill 0.35 pad 0.7)
  Top 0.254: IC9.3 30.21,36.82 30.82,36.21 33.94,36.21 36,34.15 D3.A 37.31,35.78 v37.33,35.8 | v60.19,36.56 IC7.6
  Bottom 0.254: v60.19,36.56 57.94,36.56 56.65,37.86 39.38,37.86 v37.33,35.8
N$11
  Top 0.254: D3.C 41.06,34.5 R2.2
N$12  (via drill 0.35 pad 0.7)
  Top 0.254: R2.1 37.66,40.47 C3.1 38.09,40.9 v38.09,42.02 | v58.92,41.14 IC7.5
  Bottom 0.254: v38.09,42.02 38.98,41.14 v58.92,41.14
N$14
  Top 0.254: R3.1 47.87,48.68 T1.3 43.46,53.92 42.02,55.36 IC5.2
N$15
  Top 0.254: IC5.4 44.56,58.92 42.79,60.69 40.75,60.69 39.1,59.04 T2.3 40.29,55.44 42.02,53.71 42.02,47.85 43.09,46.79 R4.1
N$16
  Top 0.254: COMP_G_(C).4 15.32,40.94 R8.1
N$17  (via drill 0.5 pad 1)
  Top 0.254: R5.2 43.44,50.95 43.41,50.91 v43.41,48.15 | OK1.1 31.1,49.26 v39.88,49.26 | v25.45,60.55 23.01,60.55 21.88,61.68 20.13,61.68 R18.2
  Bottom 0.254: OK1.1 24.61,55.76 24.61,59.24 25.39,60.02 25.39,60.55 v25.45,60.55 | v39.88,49.26 41,48.15 v43.41,48.15
N$18  (via drill 0.35 pad 0.7, 0.35 pad 0.75)
  Top 0.254: IC7.4 57.65,41.26 56.38,42.53 50.41,42.53 v46.98,45.96 | v37.33,51.17 37.71,51.55 37.71,52.8 T2.1
  Bottom 0.254: v37.33,51.17 41.77,51.17 v46.98,45.96
N$20
  Top 0.254: R16.2 5.19,50.69 R17.2 5.8,59.02 9.91,63.12 23.51,63.12 25.17,61.46 U1.2
N$21
  Bottom 0.406: F1.1_3 F1.1_1 F1.1_2 F1.1_4
N$22  (via drill 0.35 pad 0.7)
  Top 0.254: COMP_Y_(C).4 10.78,37.42 v10.78,38.34 | v10.53,40.5 10.38,40.35 R9.1 | v50.41,59.17 IC8.1
  Bottom 0.254: v10.78,38.34 10.78,40.25 v10.53,40.5 21.58,40.5 23.36,42.28 23.36,65.14 24.63,66.41 39.61,66.41 46.85,59.17 v50.41,59.17
N$23  (via drill 0.35 pad 0.7)
  Top 0.254: COMP_R_(C).4 24.05,35.49 v24.12,35.42 | IC8.2 52.3,56.36 v52.3,55.22
  Bottom 0.254: v24.12,35.42 24.12,64.76 25.01,65.65 39.1,65.65 49.53,55.22 v52.3,55.22
N$24
  Top 0.254: D4.A 13.45,44.29 13.45,42.05 R8.2 9.33,37.93 GREEN_(C_R).A
N$26
  Top 0.254: REF_(C).2 4.18,19.61 4.18,33.54 R10.1
N$27  (via drill 0.35 pad 0.7)
  Top 0.254: COMP_Y_(C).3 14.06,38.09 14.34,38.09 v14.34,38.12
  Bottom 0.254: POT_(C)_Y.2 12.18,10.85 12.18,26.28 14.08,28.18 14.34,28.44 v14.34,38.12
N$28  (via drill 0.35 pad 0.7)
  Top 0.254: R11.1 18.25,47.08 19.42,48.25 v22.59,48.25 | v52.95,59.93 IC8.3
  Bottom 0.254: v22.59,48.25 22.59,65.39 24.24,67.04 40.37,67.04 47.49,59.93 v52.95,59.93
N$29
  Top 0.254: COMP_G_(B)1.4 65.17,39.48 R12.1
N$30  (via drill 0.35 pad 0.7)
  Top 0.254: R13.1 76.67,35.93 COMP_Y_(B)1.4 76.29,34.4 v77.84,34.4 | v55.49,60.57 IC8.5
  Bottom 0.254: v77.84,34.4 81.9,34.4 82.54,35.04 82.54,46.72 81.01,48.25 81.01,66.03 79.24,67.81 76.7,67.81 69.46,60.57 v55.49,60.57
N$31  (via drill 0.35 pad 0.7)
  Top 0.254: COMP_R_(B)1.4 67.64,38.63 v67.55,38.72 | v56.76,55.11 IC8.6
  Bottom 0.254: v67.55,38.72 61.84,44.44 61.84,53.71 60.44,55.11 v56.76,55.11
N$33
  Top 0.254: D9.A 76.97,46.87 RED_(C)1.A 75.08,48.76 60.19,48.76 59.3,47.87 R15.2
N$34
  Top 0.254: D7.A 10.92,43.19 R9.2 YELLOW_(C).A
N$35
  Top 0.254: REF_(B)1.2 82.54,20.88 82.54,41.01 80.66,42.89 R14.1
N$36
  Top 0.254: COMP_Y_(B)1.3 73.1,9.29 76.57,5.83 POT_(C)_Y1.2
N$37
  Top 0.254: R15.1 53.71,49.24 53.71,56.48 IC8.4
N$38
  Top 0.254: D6.A 78.25,41.9 YELLOW_(B)1.A 80.78,39.37 R13.2
N$39
  Top 0.254: U1.6 34.32,57.04 C5.2 31.88,56.12 23.99,56.12 23,55.13 R19.2 23,51.4 21.45,52.95 17.79,52.95 R23.1
NOT_I/P  (via drill 0.35 pad 0.7)
  Top 0.254: IC9.5 IC9.6 v34.02,40.37 | IC5.3 43.17,57.24 v43.17,55.49 47.99,55.49 49.64,53.84 49.64,52.95 52.31,50.28 v52.44,50.28 | D4.C D7.C D8.C 19.04,43.8 19.93,42.91 19.93,40.84 20.4,40.37 v27.8,40.37 | D9.C D6.C 68.17,41.9 D5.C 58.93,42.01 57.65,43.29 53.07,43.29 52.49,43.88 v52.49,44.95
  Bottom 0.254: v43.17,55.49 35.04,55.49 31.36,51.8 31.36,43.04 v34.02,40.37 v27.8,40.37 | v52.49,44.95 52.49,50.23 v52.44,50.28
NOT_O/P  (via drill 0.35 pad 0.7)
  Top 0.254: IC9.2 28.94,39.48 29.32,39.87 31.23,39.87 31.48,39.61 IC9.4 31.48,39.48 33.52,41.52 36.69,41.52 37.45,42.28 37.45,45.96 38.37,46.88 39.89,46.88 41.03,48.02 41.03,49.95 R5.1 41.26,52.36 v41.26,52.69
  Bottom 0.254: v41.26,52.69 51.8,52.69 54.98,55.87 60.44,55.87 61.71,54.6 JP3.1
VCC  (via drill 0.5 pad 1)
  Top 0.406: IC5.8 40.75,64.76 42.02,66.03 48.88,66.03 50.41,64.5 | 50.41,64.5 IC8.14 | R19.1 21.81,49.64 24.12,49.64 24.63,50.15 24.63,53.71 26.28,55.36 C5.1 31.34,54.23 v31.36,54.22 | U1.4 v25.39,58.92 | v38.47,63.49 38.49,63.51 IC5.8 | IC5.8 38.47,61.23 38.47,56.88 35.67,54.09 33.64,54.09 32.63,53.07 v32.63,50.28 30.59,52.31 v29.83,52.31 | v39.61,43.29 39.61,45.12 R4.2 | IC7.14 53.61,45.22 50.88,47.95 | 50.88,47.95 R3.2 | v50.66,46.09 50.66,47.74 50.88,47.95 | POT_(C)_Y.3 9.39,10.59 9.39,18.28 8.62,19.04 REF_(C).3 | POT_(C)_R.3 10.75,33.03 COMP_Y_(C).5 15.58,30.66 POT_(C)_G.3 | COMP_G_(C).5 17.89,35.49 | 17.89,35.49 COMP_G_(C).1 COMP_R_(C).3 20.73,35.49 COMP_R_(C).5 23.53,37.39 v25.5,35.42 | POT_(C)_G.3 17.89,31.29 17.89,35.49 | POT_(C)_G.3 POT_(C)_G.2 | v27.42,32.12 28.41,32.12 IC1.5 | v27.67,46.09 IC9.14 | POT_(C)_Y2.3 53.77,29.01 v54.34,28.44 | IC2.5 54.93,30.01 v54.46,30.01 | COMP_G_(B)1.5 61.14,34.98 v60.25,34.09 63.87,30.47 POT_(B)_G1.3 | POT_(B)_G1.3 65.17,31.71 COMP_G_(B)1.1 COMP_R_(B)1.5 66.41,33.74 POT_(B)_G1.2 POT_(B)_G1.3 | COMP_Y_(B)1.5 74.28,35.45 74.28,31.99 74.92,31.36 78.47,31.36 80,29.83 80,25.39 78.22,23.61 POT_(B)_R1.3 | K2.1 52.55,66.65 50.41,64.5
  Bottom 0.406: v25.39,58.92 25.39,56.88 27.93,54.34 27.97,54.34 28.09,54.22 v31.36,54.22 38.47,61.33 v38.47,63.49 | v32.63,50.28 32.63,47.87 37.2,43.29 v39.61,43.29 47.99,43.29 50.66,45.96 v50.66,46.09 | REF_(C).3 5.58,20.75 5.58,25.9 6.72,27.04 POT_(C)_R.2 POT_(C)_R.3 | POT_(C)_Y2.3 51.93,29.45 50.41,30.98 42.85,30.98 REF_(C)2.3 37.52,32.12 v27.42,32.12 22.53,32.12 POT_(C)_G.2 | v29.83,52.31 29.83,48.25 v27.67,46.09 25.51,43.93 25.51,35.42 v25.5,35.42 | v54.34,28.44 54.46,28.55 v54.46,30.01 56.05,30.01 60.19,34.15 v60.25,34.09 | REF_(B)1.3 74.92,16.43 74.92,22.85 75.68,23.61 POT_(B)_R1.3 73.2,23.61 POT_(B)_G1.2
WFDC_B  (via drill 0.35 pad 0.7, 0.35 pad 0.75)
  Top 0.254: GREEN_(B_R)1.A 67.22,46.11 D5.A 68.08,46.09 v71.33,46.09 | v71.36,41.01 71.61,41.01 71.85,40.77 71.86,40.77 72.12,40.5 72.12,39.87 72.5,39.48 R12.2 73.8,38.1 v73.89,38.01 | v81.55,21.26 74.02,21.26 v73.99,21.29
  Bottom 0.254: v71.36,41.01 71.36,46.09 v71.33,46.09 | v73.89,38.01 73.89,35.85 76.14,33.6 80.09,33.6 81.55,32.14 v81.55,21.26 | v73.99,21.29 55.19,21.29 53.37,19.46 53.37,17.29 J1.7
WFDC_C  (via drill 0.5 pad 1)
  Top 0.254: R11.2 21.85,45.59 D8.A 21.85,42.26 RED_(C).A 21.21,41.15 v23.33,41.15
  Bottom 0.254: J1.8 49.2,19.12 47.22,21.11 25.27,21.11 16,30.38 16,31.92 18.96,34.87 18.96,37.85 20.99,39.88 22.47,39.88 23.33,40.74 v23.33,41.15
(copper drawn outside any net)
  shapes: Top area x2

### Text on the board
tNames: TKR | BSPD | 21-08-2010